# Altium schematic sheet HB_UNIT.SchDoc
size A0; SheetNumber: 1; SheetTotal: 1; SPICEModelCacheAAJFOWTS: <root> / <DocumentId>AAJFOWTS</DocumentId> / </root>
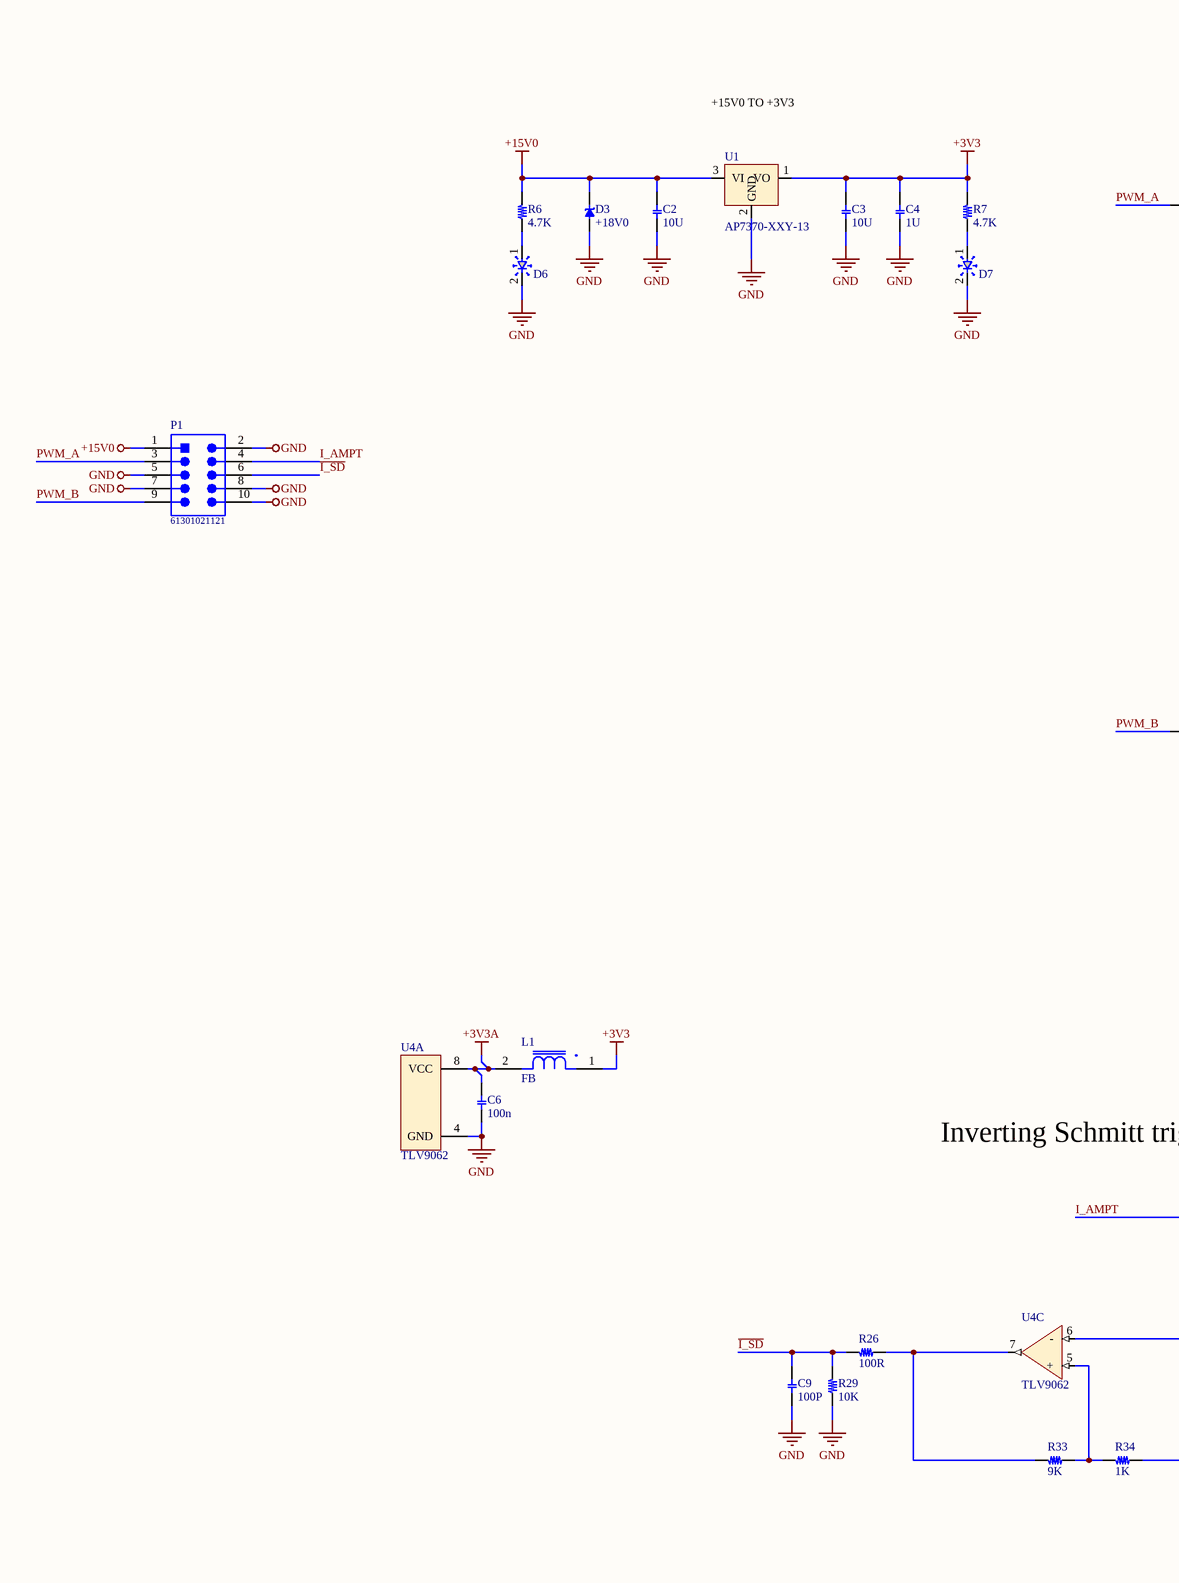
[diagram p0: HB_UNIT.SchDoc, left]
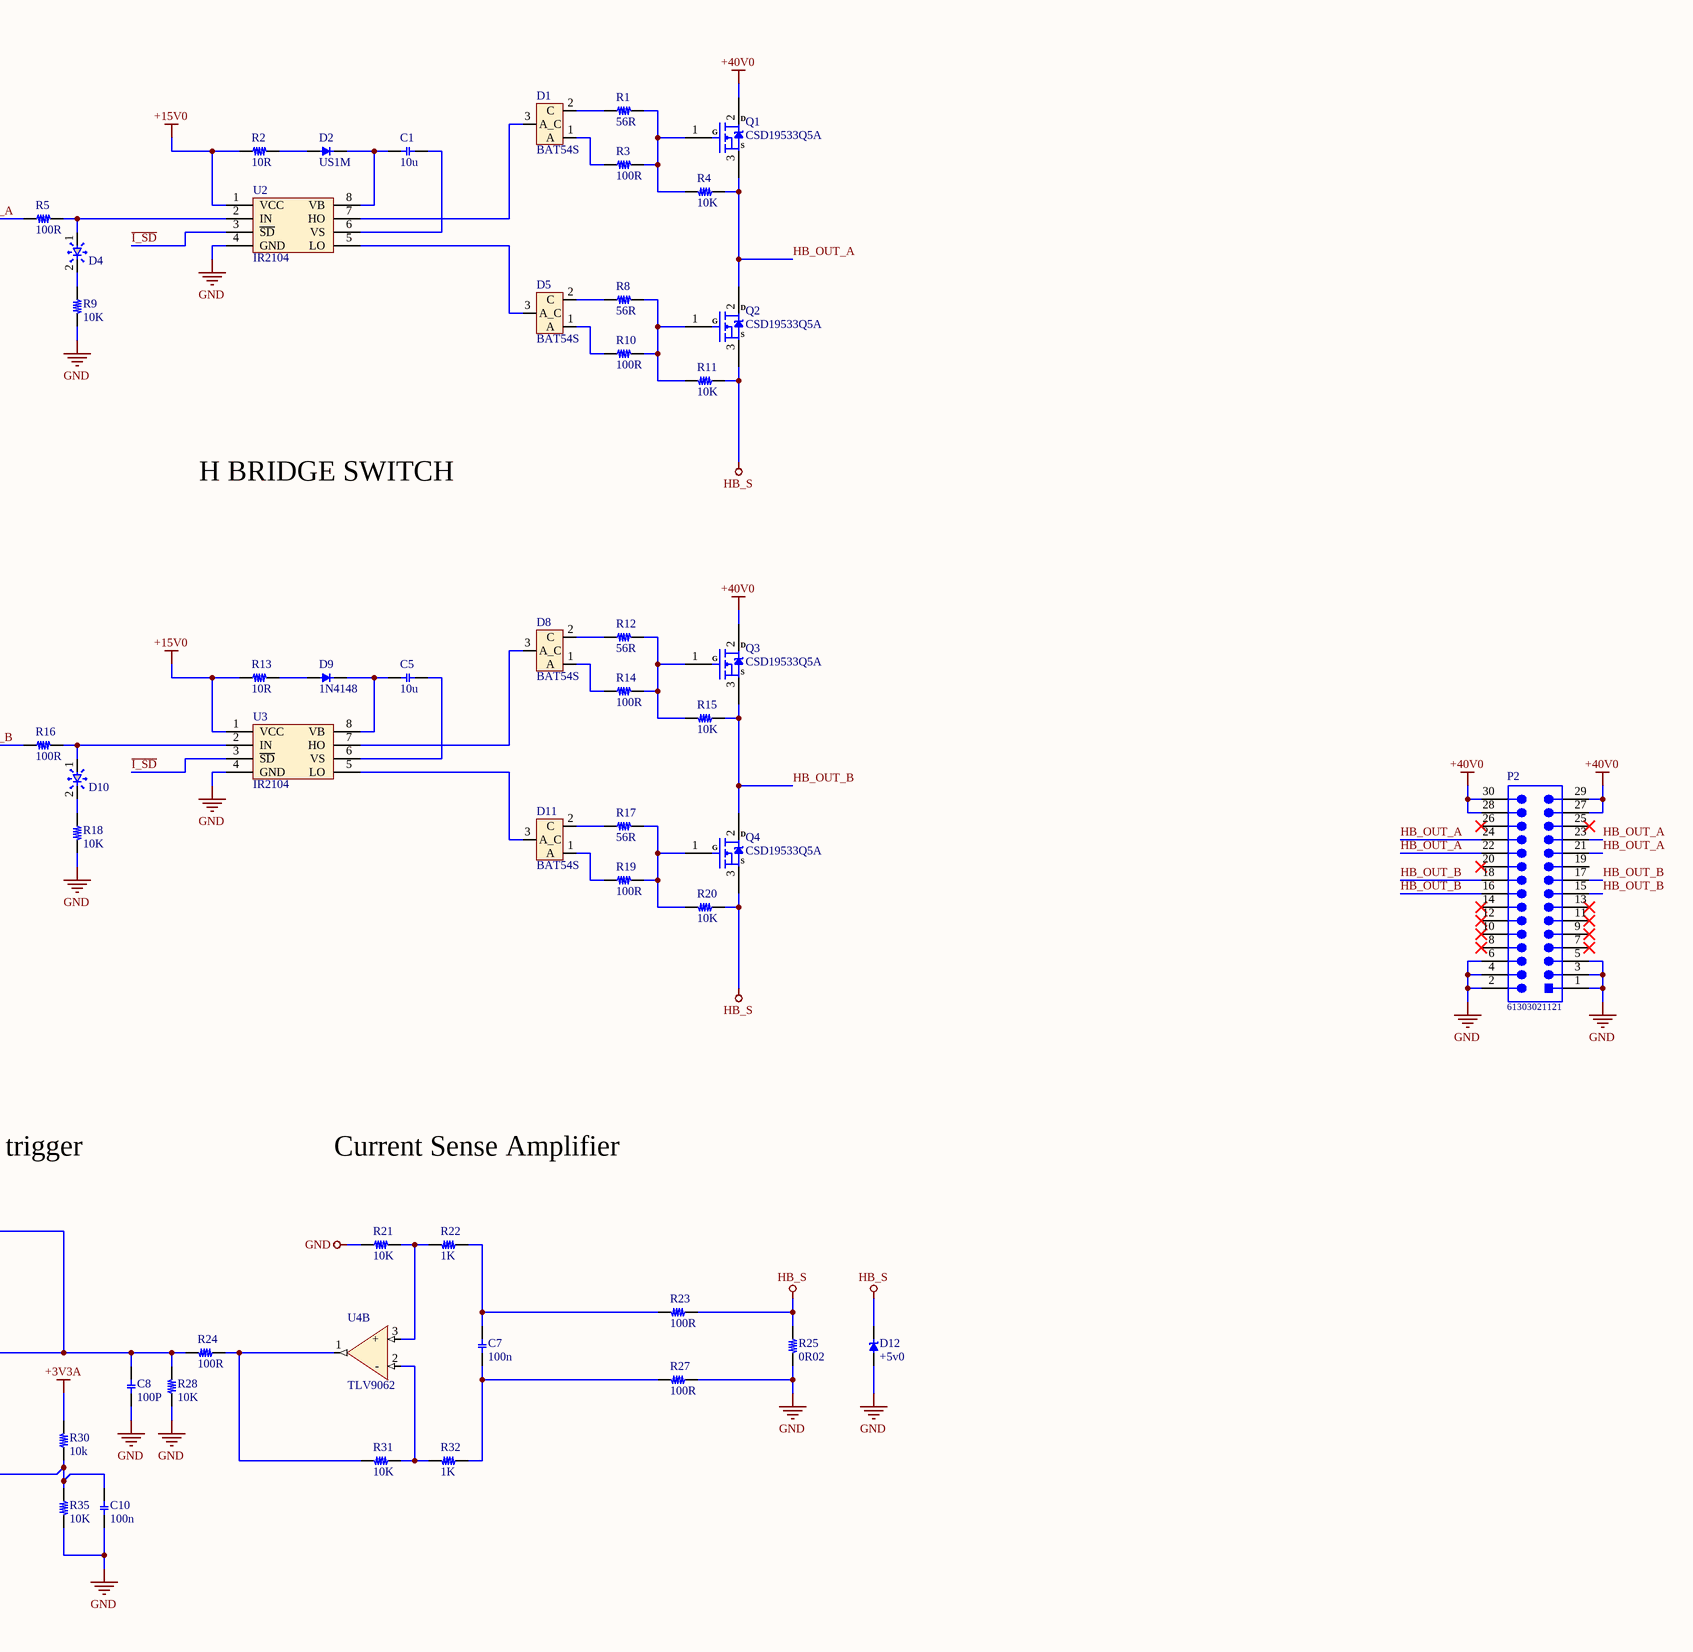
[diagram p1: HB_UNIT.SchDoc, right]

## Parts
C1  10u  [C 0805]
C2  10U  [C 0603]
C3  10U  [C 0603]
C4  1U  [C 0603]
C5  10u  [C 0805]
C6  100n  [C 0603]
C7  100n  [C 0603]
C8  100P  [C 0603]
C9  100P  [C 0603]
C10  100n  [C 0603]
D1  BAT54S  [SOT-23_3_D]
D2  US1M  [D SOD-123]
D3  +18V0  [DIOD_SMB]
D4  LED_SMD  [D 0603]  (value not drawn)
D5  BAT54S  [SOT-23_3_D]
D6  LED_SMD  [D 0603]  (value not drawn)
D7  LED_SMD  [D 0603]  (value not drawn)
D8  BAT54S  [SOT-23_3_D]
D9  1N4148  [D SOD-123]
D10  LED_SMD  [D 0603]  (value not drawn)
D11  BAT54S  [SOT-23_3_D]
D12  +5v0  [DIOD_SMB]
L1  FB  [L 0603]
P1  61301021121  [61301021121]
P2  61303021121  [61303021121]
Q1  CSD19533Q5A  [Q5A]
Q2  CSD19533Q5A  [Q5A]
Q3  CSD19533Q5A  [Q5A]
Q4  CSD19533Q5A  [Q5A]
R1  56R  [R 0805]
R2  10R  [R 0805]
R3  100R  [R 0805]
R4  10K  [R 0603]
R5  100R  [R 0603]
R6  4.7K  [R 0603]
R7  4.7K  [R 0603]
R8  56R  [R 0805]
R9  10K  [R 0603]
R10  100R  [R 0805]
R11  10K  [R 0603]
R12  56R  [R 0805]
R13  10R  [R 0805]
R14  100R  [R 0805]
R15  10K  [R 0603]
R16  100R  [R 0603]
R17  56R  [R 0805]
R18  10K  [R 0603]
R19  100R  [R 0805]
R20  10K  [R 0603]
R21  10K  [R 0603]
R22  1K  [R 0603]
R23  100R  [R 0603]
R24  100R  [R 0603]
R25  0R02  [R 2512]
R26  100R  [R 0603]
R27  100R  [R 0603]
R28  10K  [R 0603]
R29  10K  [R 0603]
R30  10k  [R 0603]
R31  10K  [R 0603]
R32  1K  [R 0603]
R33  9K  [R 0603]
R34  1K  [R 0603]
R35  10K  [R 0603]
U1  AP7370-XXY-13  [SOT89-U]
U2  IR2104  [SOIC-8]
U3  IR2104  [SOIC-8]
U4  TLV9062  [SOIC-8]  (parts A,B,C of 3)

## Nets
+3V3: C3.2 C4.2 L1.1 R7.2 U1.1(VO)
+3V3A: C6.2 L1.2 R30.1 U4.8(VCC)
+15V0: C2.2 D3.2 P1.1 R2.1 R6.2 R13.1 U1.3(VI) U2.1(VCC) U3.1(VCC)
+40V0: P2.27 P2.28 P2.29 P2.30 Q1.2(D) Q3.2(D)
GND: C2.1 C3.1 C4.1 C6.1 C8.1 C9.1 C10.2 D3.1 D6.2 D7.2 D12.1 P1.2 P1.5 P1.7 P1.8 P1.10 P2.1 P2.2 P2.3 P2.4 P2.5 P2.6 R9.1 R18.1 R21.1 R25.1 R27.1 R28.1 R29.1 R35.1 U1.2(GND) U2.4(GND) U3.4(GND) U4.4(GND)
HB_S: D12.2 Q2.3(S) Q4.3(S) R11.1 R20.1 R23.1 R25.2
HB_OUT_A: P2.21 P2.22 P2.23 P2.24 Q1.3(S) Q2.2(D) R4.1
HB_OUT_B: P2.15 P2.16 P2.17 P2.18 Q3.3(S) Q4.2(D) R15.1
~{I_SD}: C9.2 P1.6 R26.2 R29.2 U2.3(~{SD}) U3.3(~{SD})
I_AMPT: C8.2 P1.4 R24.2 R28.2 U4.6(-)
PWM_A: P1.3 R5.1
PWM_B: P1.9 R16.1
NetC1_1: C1.1 D2.2 U2.8(VB)
NetC1_2: C1.2 U2.6(VS)
NetC5_1: C5.1 D9.2 U3.8(VB)
NetC5_2: C5.2 U3.6(VS)
NetC7_1: C7.1 R27.2 R32.1
NetC7_2: C7.2 R22.1 R23.2
NetC10_1: C10.1 R30.2 R34.1 R35.2
NetD1_1: D1.1(A) R3.1
NetD1_2: D1.2(C) R1.1
NetD1_3: D1.3(A_C) U2.7(HO)
NetD2_1: D2.1 R2.2
NetD4_1: D4.1 R5.2 U2.2(IN)
NetD4_2: D4.2 R9.2
NetD5_1: D5.1(A) R10.1
NetD5_2: D5.2(C) R8.1
NetD5_3: D5.3(A_C) U2.5(LO)
NetD6_1: D6.1 R6.1
NetD7_1: D7.1 R7.1
NetD8_1: D8.1(A) R14.1
NetD8_2: D8.2(C) R12.1
NetD8_3: D8.3(A_C) U3.7(HO)
NetD9_1: D9.1 R13.2
NetD10_1: D10.1 R16.2 U3.2(IN)
NetD10_2: D10.2 R18.2
NetD11_1: D11.1(A) R19.1
NetD11_2: D11.2(C) R17.1
NetD11_3: D11.3(A_C) U3.5(LO)
NetQ1_1: Q1.1(G) R1.2 R3.2 R4.2
NetQ2_1: Q2.1(G) R8.2 R10.2 R11.2
NetQ3_1: Q3.1(G) R12.2 R14.2 R15.2
NetQ4_1: Q4.1(G) R17.2 R19.2 R20.2
NetR21_2: R21.2 R22.2 U4.3(+)
NetR24_1: R24.1 R31.2 U4.1(OUT)
NetR26_1: R26.1 R33.2 U4.7(OUT)
NetR31_1: R31.1 R32.2 U4.2(-)
NetR33_1: R33.1 R34.2 U4.5(+)

Not connected (* = marked no-connect by the designer): P2 7* 8* 9* 10* 11* 12* 13* 14* 19 20* 25* 26*

## Notes on the sheet
- +15V0 TO +3V3
- H BRIDGE SWITCH
- Inverting Schmitt trigger
- Current Sense Amplifier

## Library data of the parts
C1-C10 = CAP_SMD
D2 D9 = DIOD_SMD
D3 D12 = DIOD_SMD_TVS_UI: TVS_UI
L1 = Inductor
P1 = 61301021121: WR-PHD Pin Header, THT, pitch 2.54mm, Dual Row, Vertical, 10p; Manufacturer: Wurth Elektronik; Pin Number: 10; Rated Current: 3A; Working Voltage: 250VAC; Withstanding Voltage: 500VAC; Contact Resistance: 20mOhm; ComponentLink1Description: Manufacturer; ComponentLink1URL: http://www.we-online.de; ComponentLink2Description: Datasheet; ComponentLink2URL: https://www.we-online.com/catalog/datasheet/61301021121.pdf; Manufacturer Part Number: 61301021121; Pitch: 2.54mm; Operating Temperature: -40 to +105degC; Mounting Technology: THT; Packaging: Bag; Gender: Pin Header; Row Number: Dual; Orientation: Vertical
P2 = 61303021121: WR-PHD Pin Header, THT, pitch 2.54mm, Dual Row, Vertical, 30p; Manufacturer: Wurth Elektronik; Pin Number: 30; Rated Current: 3A; Working Voltage: 250VAC; Withstanding Voltage: 500VAC; Contact Resistance: 20mOhm; ComponentLink1Description: Manufacturer; ComponentLink1URL: http://www.we-online.de; ComponentLink2Description: Datasheet; ComponentLink2URL: https://www.we-online.com/catalog/datasheet/61303021121.pdf; Manufacturer Part Number: 61303021121; Pitch: 2.54mm; Operating Temperature: -40 to +105degC; Mounting Technology: THT; Packaging: Bag; Gender: Pin Header; Row Number: Dual; Orientation: Vertical
R1-R35 = RES_SMD